# EAGLE schematic schematic (EAGLE 7.5.0)

## Sheet 1 of 2
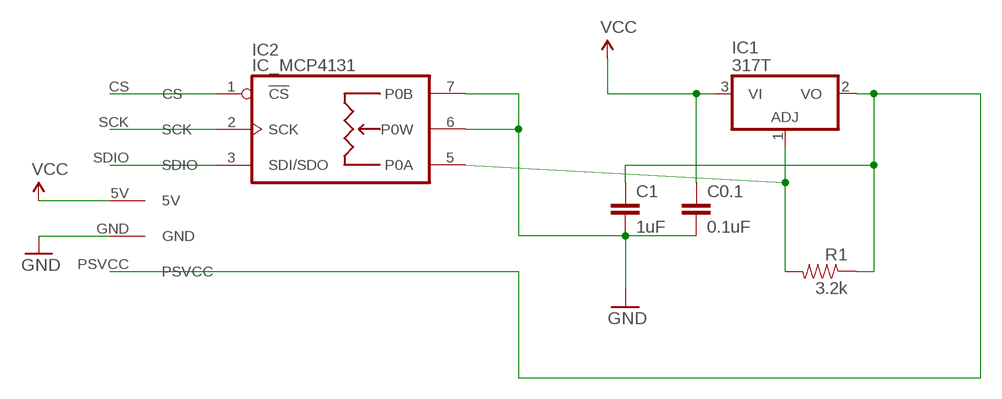
[diagram p0: schematic, sheet 1]

### Parts
C0.1  0.1uF  0.1UF-50V-20%(PTH)KIT-EZ  [CAP-PTH-SMALL-KIT]
C1  1uF  0.1UF-50V-20%(PTH)KIT-EZ  [CAP-PTH-SMALL-KIT]
IC1  317T  [TO220H]
IC2  IC_MCP4131  [DIP8]
R1  3.2k  RESISTORAXIAL-0.3  [AXIAL-0.3]
U$1  PS_CONNNORMAL  [PS_CONN]

### Nets
GND: C0.1.2 C1.2 IC2.6(P0W) IC2.7(P0B) U$1.GND
N$1: IC1.1(ADJ) IC2.5(P0A) R1.P$2
N$2: IC2.3(SDI/SDO) U$1.SDIO
N$3: IC2.2(SCK) U$1.SCK
N$4: C1.1 IC1.2(VO) R1.P$1 U$1.PSVCC
N$5: IC2.1(!CS) U$1.CS
VCC: C0.1.1 IC1.3(VI) U$1.5V
Unconnected: IC2.4(GND) IC2.8(V+)

## Sheet 2 of 2

## Library data of the parts
C0.1 C1 = SparkFun-Capacitors:0.1UF-50V-20%(PTH): CAP-08370; PROD_ID: CAP-08370
IC1 = linear:*317: Positive VOLTAGE REGULATOR
IC2 = dp_devices:IC_MCP4131: 7/8 Bit SPI Digital POT with volatile memory MCP4131 <http://www.microchip.com/wwwproducts/Devices.aspx?dDocName=en531882>
R1 = SparkFun-Passives:RESISTOR: Resistor Basic schematic elements and footprints for 0603, 1206, and PTH resistors.
U$1 = SLV:PS_CONN